# Altium project LM2576_Buckconverter.PrjPcb
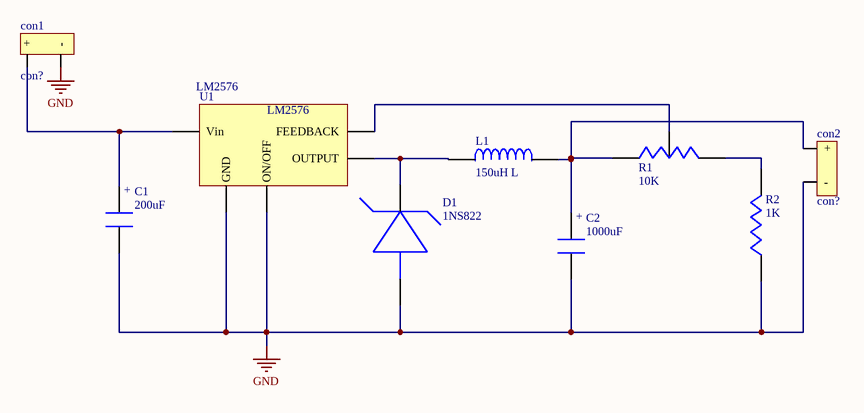
[diagram p0: LM2576_Buckconverter.SchDoc]
1 sheet, 9 parts. Net scope: global (net labels, ports and power ports of the same name join across sheets).
Board file: LM2576_Buckconverter.PcbDoc

## Sheet LM2576_Buckconverter.SchDoc
size 199 x 129 mm

### Parts
C1  200uF  [220uF Capacitor]
C2  1000uF  [1000UF CAP]
con1  con?  [2pin]
con2  con?  [2pin]
D1  1NS822  [1N5822]
L1  150uH L  [150uH Inductor]
R1  10K  [10K POT]
R2  1K  [1K 1206 Resistor]
U1  LM2576  [LM2576-TO63-S]

### Nets
GND: C1.2 C2.2 con1.2(-) con2.2(-) D1.2 R2.1 U1.3(GND) U1.5(ON/OFF)
NetC1_1: C1.1 con1.1(+) U1.1(Vin)
NetC2_1: C2.1 con2.1(+) L1.2 R1.1
NetD1_1: D1.1 L1.1 U1.2(OUTPUT)
NetR1_2: R1.2 R2.2
NetR1_3: R1.3 U1.4(FEEDBACK)

### Notes on the sheet
- (in symbol Electrolytic Cap) +

### Library data of the parts
C1 C2 = Electrolytic Cap
con1 con2 = 2pinconnector
R1 = Variable Resistor
R2 = Resistor